# EAGLE schematic P1001-001-011-320 - RAM (EAGLE 9.4.2)

## Sheet 1 of 4
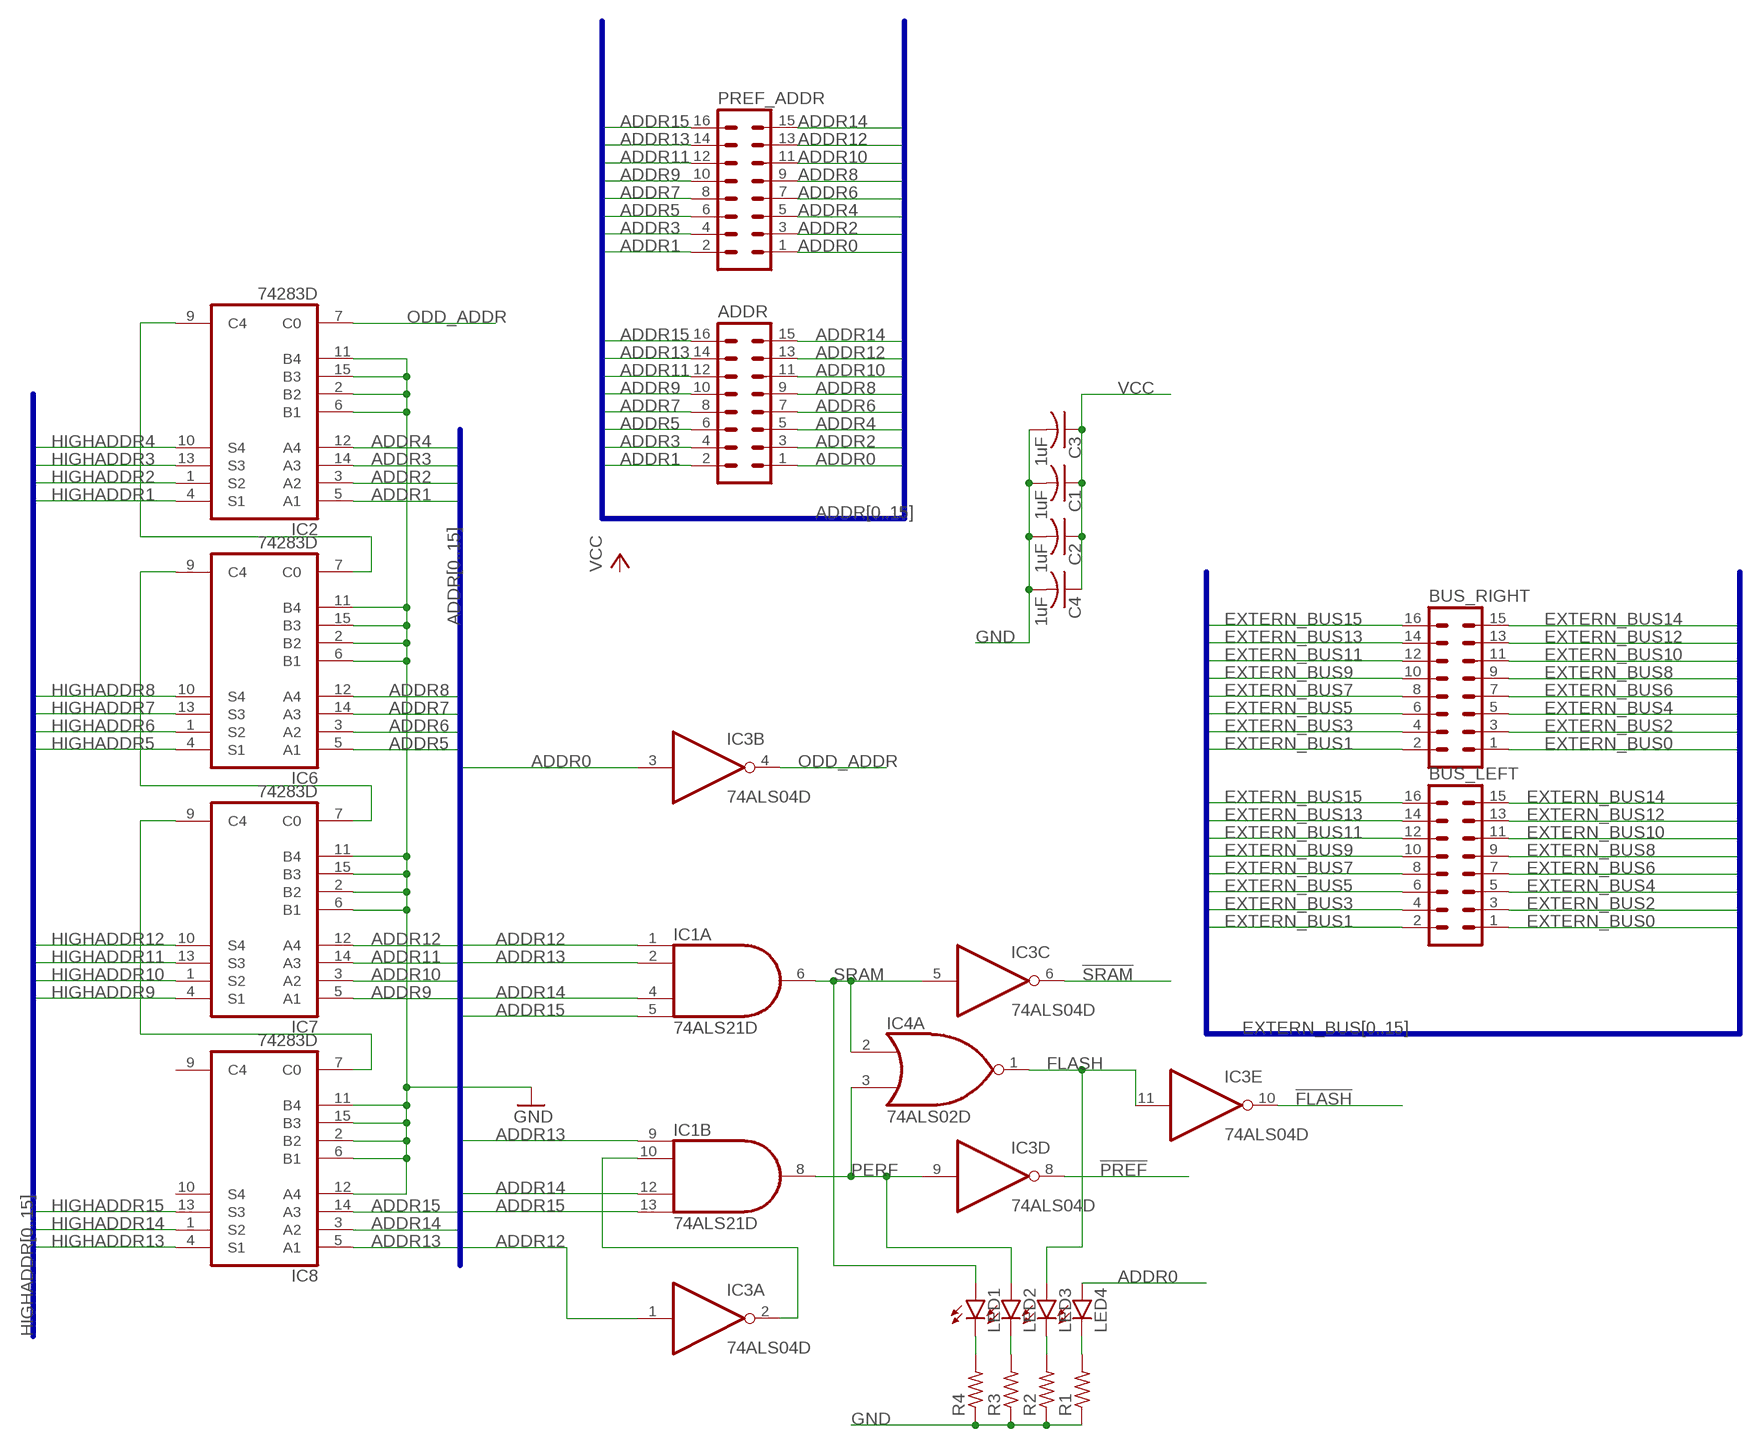
[diagram p0: schematic, sheet 1]

### Parts
ADDR  ML16  [ML16]
BUS_LEFT  ML16  [ML16]
BUS_RIGHT  ML16  [ML16]
C1  1uF  C-USC1206  [C1206]
C2  1uF  C-USC1206  [C1206]
C3  1uF  C-USC1206  [C1206]
C4  1uF  C-USC1206  [C1206]
IC1  74ALS21D  [SO14]
IC2  74283D  [SO16]
IC3  74ALS04D  [SO14]
IC4  74ALS02D  [SO14]
IC6  74283D  [SO16]
IC7  74283D  [SO16]
IC8  74283D  [SO16]
LED1  LED5MM  [LED5MM]
LED2  LED5MM  [LED5MM]
LED3  LED5MM  [LED5MM]
LED4  LED5MM  [LED5MM]
PREF_ADDR  ML16  [ML16]
R1  R-US_M1206  [M1206]
R2  R-US_M1206  [M1206]
R3  R-US_M1206  [M1206]
R4  R-US_M1206  [M1206]

### Nets
!FLASH: IC3.10(E:O) ; also sheet 3
!PREF: IC3.8(D:O) ; also sheet 4
!SRAM: IC3.6(C:O) ; also sheet 4
ADDR0: ADDR.1 IC3.3(B:I) LED4.A PREF_ADDR.1 ; also sheet 4
ADDR1: ADDR.2 IC2.5(A1) PREF_ADDR.2 ; also sheet 3,4
ADDR2: ADDR.3 IC2.3(A2) PREF_ADDR.3 ; also sheet 3,4
ADDR3: ADDR.4 IC2.14(A3) PREF_ADDR.4 ; also sheet 3,4
ADDR4: ADDR.5 IC2.12(A4) PREF_ADDR.5 ; also sheet 3,4
ADDR5: ADDR.6 IC6.5(A1) PREF_ADDR.6 ; also sheet 3,4
ADDR6: ADDR.7 IC6.3(A2) PREF_ADDR.7 ; also sheet 3,4
ADDR7: ADDR.8 IC6.14(A3) PREF_ADDR.8 ; also sheet 3,4
ADDR8: ADDR.9 IC6.12(A4) PREF_ADDR.9 ; also sheet 3,4
ADDR9: ADDR.10 IC7.5(A1) PREF_ADDR.10 ; also sheet 3,4
ADDR10: ADDR.11 IC7.3(A2) PREF_ADDR.11 ; also sheet 3,4
ADDR11: ADDR.12 IC7.14(A3) PREF_ADDR.12 ; also sheet 3,4
ADDR12: ADDR.13 IC1.1(A:I0) IC3.1(A:I) IC7.12(A4) PREF_ADDR.13 ; also sheet 3,4
ADDR13: ADDR.14 IC1.2(A:I1) IC1.9(B:I0) IC8.5(A1) PREF_ADDR.14 ; also sheet 3,4
ADDR14: ADDR.15 IC1.4(A:I2) IC1.12(B:I2) IC8.3(A2) PREF_ADDR.15 ; also sheet 3,4
ADDR15: ADDR.16 IC1.5(A:I3) IC1.13(B:I3) IC8.14(A3) PREF_ADDR.16 ; also sheet 3,4
EXTERN_BUS0: BUS_LEFT.1 BUS_RIGHT.1 ; also sheet 4
EXTERN_BUS1: BUS_LEFT.2 BUS_RIGHT.2 ; also sheet 4
EXTERN_BUS2: BUS_LEFT.3 BUS_RIGHT.3 ; also sheet 4
EXTERN_BUS3: BUS_LEFT.4 BUS_RIGHT.4 ; also sheet 4
EXTERN_BUS4: BUS_LEFT.5 BUS_RIGHT.5 ; also sheet 4
EXTERN_BUS5: BUS_LEFT.6 BUS_RIGHT.6 ; also sheet 4
EXTERN_BUS6: BUS_LEFT.7 BUS_RIGHT.7 ; also sheet 4
EXTERN_BUS7: BUS_LEFT.8 BUS_RIGHT.8 ; also sheet 4
EXTERN_BUS8: BUS_LEFT.9 BUS_RIGHT.9 ; also sheet 4
EXTERN_BUS9: BUS_LEFT.10 BUS_RIGHT.10 ; also sheet 4
EXTERN_BUS10: BUS_LEFT.11 BUS_RIGHT.11 ; also sheet 4
EXTERN_BUS11: BUS_LEFT.12 BUS_RIGHT.12 ; also sheet 4
EXTERN_BUS12: BUS_LEFT.13 BUS_RIGHT.13 ; also sheet 4
EXTERN_BUS13: BUS_LEFT.14 BUS_RIGHT.14 ; also sheet 4
EXTERN_BUS14: BUS_LEFT.15 BUS_RIGHT.15 ; also sheet 4
EXTERN_BUS15: BUS_LEFT.16 BUS_RIGHT.16 ; also sheet 4
FLASH: IC3.11(E:I) IC4.1(A:O) LED3.A
GND [power]: C1.2 C2.2 C3.2 C4.2 IC2.2(B2) IC2.6(B1) IC2.11(B4) IC2.15(B3) IC6.2(B2) IC6.6(B1) IC6.11(B4) IC6.15(B3) IC7.2(B2) IC7.6(B1) IC7.11(B4) IC7.15(B3) IC8.2(B2) IC8.6(B1) IC8.11(B4) IC8.12(A4) IC8.15(B3) R1.1 R2.1 R3.1 R4.1 ; also sheet 2,3,4
HIGHADDR1: IC2.4(S1) ; also sheet 3,4
HIGHADDR2: IC2.1(S2) ; also sheet 3,4
HIGHADDR3: IC2.13(S3) ; also sheet 3,4
HIGHADDR4: IC2.10(S4) ; also sheet 3,4
HIGHADDR5: IC6.4(S1) ; also sheet 3,4
HIGHADDR6: IC6.1(S2) ; also sheet 3,4
HIGHADDR7: IC6.13(S3) ; also sheet 3,4
HIGHADDR8: IC6.10(S4) ; also sheet 3,4
HIGHADDR9: IC7.4(S1) ; also sheet 3,4
HIGHADDR10: IC7.1(S2) ; also sheet 3,4
HIGHADDR11: IC7.13(S3) ; also sheet 3,4
HIGHADDR12: IC7.10(S4) ; also sheet 3,4
HIGHADDR13: IC8.4(S1) ; also sheet 3,4
HIGHADDR14: IC8.1(S2) ; also sheet 3,4
HIGHADDR15: IC8.13(S3) ; also sheet 3,4
N$1: IC1.10(B:I1) IC3.2(A:O)
N$3: LED1.K(C) R4.2
N$4: LED2.K(C) R3.2
N$5: LED3.K(C) R2.2
N$6: LED4.K(C) R1.2
N$37: IC2.9(C4) IC6.7(C0)
N$42: IC6.9(C4) IC7.7(C0)
N$50: IC7.9(C4) IC8.7(C0)
ODD_ADDR: IC2.7(C0) IC3.4(B:O) ; also sheet 2,3,4
PERF: IC1.8(B:O) IC3.9(D:I) IC4.3(A:I1) LED2.A
SRAM: IC1.6(A:O) IC3.5(C:I) IC4.2(A:I0) LED1.A
VCC [power]: C1.1 C2.1 C3.1 C4.1 ; also sheet 2,3,4
Unconnected: IC3.12(F:O) IC3.13(F:I) IC4.4(B:O) IC4.5(B:I0) IC4.6(B:I1) IC4.8(C:I0) IC4.9(C:I1) IC4.10(C:O) IC4.11(D:I0) IC4.12(D:I1) IC4.13(D:O) IC8.9(C4) IC8.10(S4)

### Buses
ADDR[0..15]
HIGHADDR[0..15]
EXTERN_BUS[0..15]

## Sheet 2 of 4
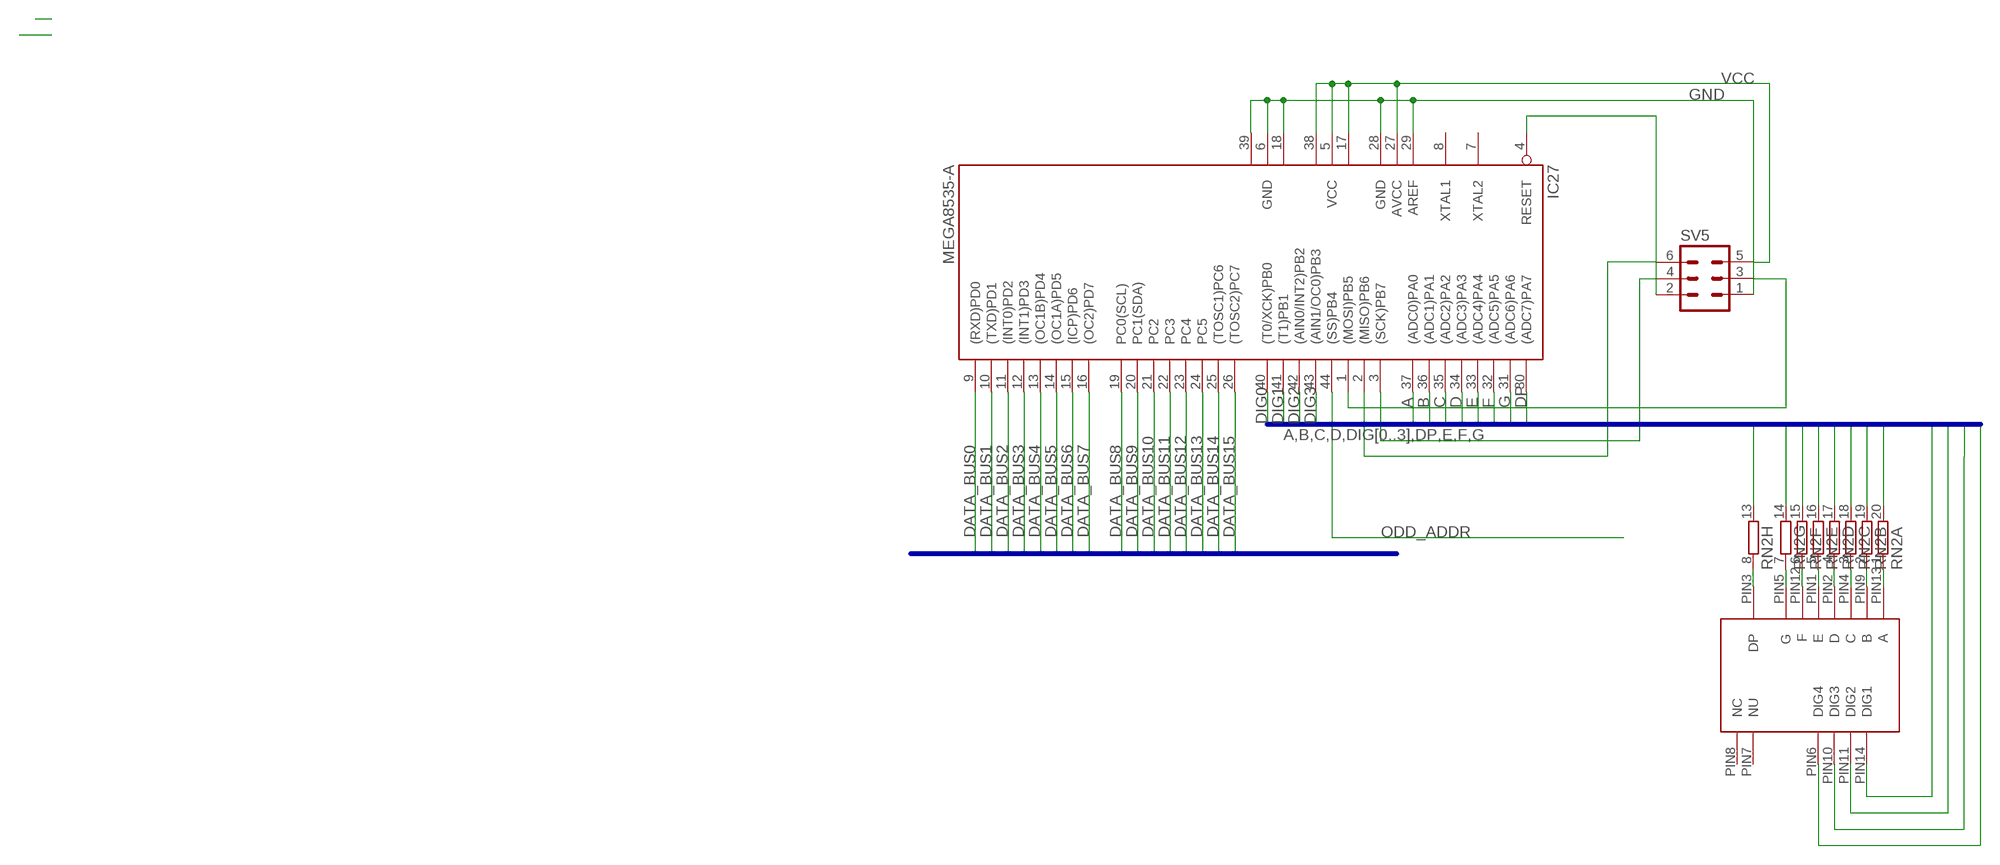
[diagram p1: schematic, sheet 2]

### Parts
IC27  MEGA8535-A  [TQFP44]
RN2  10R-NSOMC  [SOMC20]
SV5  ML6  [ML6]
U$1  4-DIGIT-7-SEGMENT  [4-DIGIT-7-SEGMENT]

### Nets
A: IC27.37((ADC0)PA0) RN2.20
B: IC27.36((ADC1)PA1) RN2.19
C: IC27.35((ADC2)PA2) RN2.18
D: IC27.34((ADC3)PA3) RN2.17
DATA_BUS0: IC27.9((RXD)PD0) ; also sheet 3,4
DATA_BUS1: IC27.10((TXD)PD1) ; also sheet 3,4
DATA_BUS2: IC27.11((INT0)PD2) ; also sheet 3,4
DATA_BUS3: IC27.12((INT1)PD3) ; also sheet 3,4
DATA_BUS4: IC27.13((OC1B)PD4) ; also sheet 3,4
DATA_BUS5: IC27.14((OC1A)PD5) ; also sheet 3,4
DATA_BUS6: IC27.15((ICP)PD6) ; also sheet 3,4
DATA_BUS7: IC27.16((OC2)PD7) ; also sheet 3,4
DATA_BUS8: IC27.19(PC0(SCL)) ; also sheet 3,4
DATA_BUS9: IC27.20(PC1(SDA)) ; also sheet 3,4
DATA_BUS10: IC27.21(PC2) ; also sheet 3,4
DATA_BUS11: IC27.22(PC3) ; also sheet 3,4
DATA_BUS12: IC27.23(PC4) ; also sheet 3,4
DATA_BUS13: IC27.24(PC5) ; also sheet 3,4
DATA_BUS14: IC27.25((TOSC1)PC6) ; also sheet 3,4
DATA_BUS15: IC27.26((TOSC2)PC7) ; also sheet 3,4
DIG0: IC27.40((T0/XCK)PB0) U$1.PIN14(DIG1)
DIG1: IC27.41((T1)PB1) U$1.PIN11(DIG2)
DIG2: IC27.42((AIN0/INT2)PB2) U$1.PIN10(DIG3)
DIG3: IC27.43((AIN1/OC0)PB3) U$1.PIN6(DIG4)
DP: IC27.30((ADC7)PA7) RN2.13
E: IC27.33((ADC4)PA4) RN2.16
F: IC27.32((ADC5)PA5) RN2.15
G: IC27.31((ADC6)PA6) RN2.14
GND [power]: IC27.6(GND) IC27.18(GND1) IC27.28(GND) IC27.29(AREF) IC27.39(GND2) SV5.1 ; also sheet 1,3,4
N$119: IC27.1((MOSI)PB5) SV5.3
N$120: IC27.3((SCK)PB7) SV5.4
N$121: IC27.2((MISO)PB6) SV5.6
N$122: IC27.4(RESET) SV5.2
N$123: RN2.1 U$1.PIN13(A)
N$124: RN2.2 U$1.PIN9(B)
N$125: RN2.3 U$1.PIN4(C)
N$126: RN2.4 U$1.PIN2(D)
N$127: RN2.5 U$1.PIN1(E)
N$128: RN2.6 U$1.PIN12(F)
N$129: RN2.7 U$1.PIN5(G)
N$130: RN2.8 U$1.PIN3(DP)
ODD_ADDR: IC27.44((SS)PB4) ; also sheet 1,3,4
VCC [power]: IC27.5(VCC) IC27.17(VCC1) IC27.27(AVCC) IC27.38(VCC2) SV5.5 ; also sheet 1,3,4
Unconnected: IC27.7(XTAL2) IC27.8(XTAL1) RN2.9 RN2.10 RN2.11 RN2.12 U$1.PIN7(NU) U$1.PIN8(NC)

### Buses
A,B,C,D,DIG[0..3],DP,E,F,G
DATA_BUS[0..15]

## Sheet 3 of 4
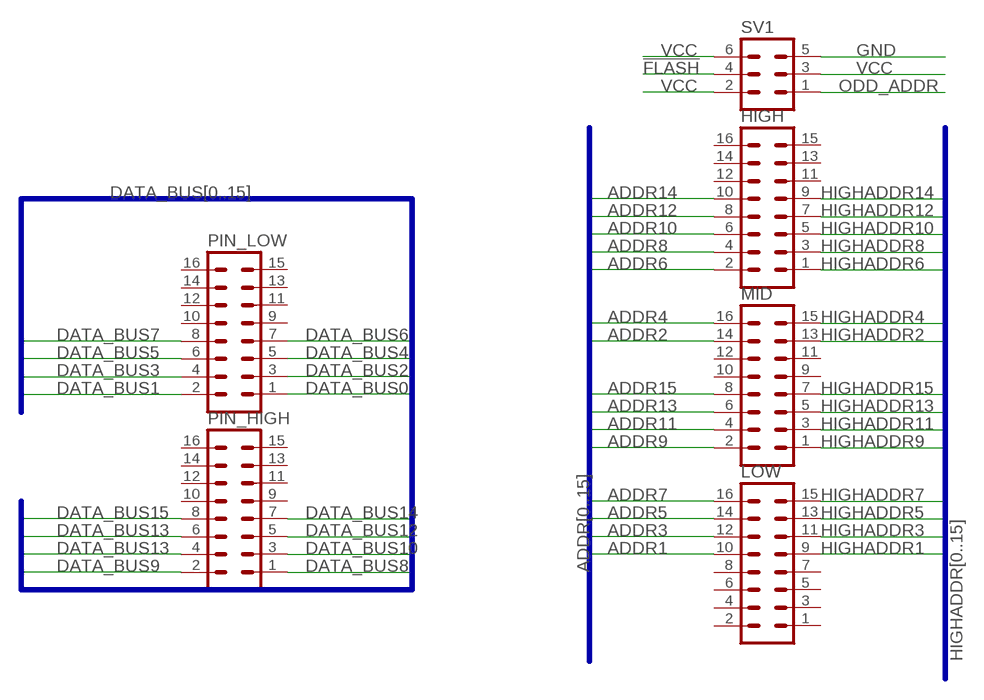
[diagram p2: schematic, sheet 3]

### Parts
HIGH  ML16  [ML16]
LOW  ML16  [ML16]
MID  ML16  [ML16]
PIN_HIGH  ML16  [ML16]
PIN_LOW  ML16  [ML16]
SV1  ML6  [ML6]

### Nets
!FLASH: SV1.4 ; also sheet 1
ADDR1: LOW.10 ; also sheet 1,4
ADDR2: MID.14 ; also sheet 1,4
ADDR3: LOW.12 ; also sheet 1,4
ADDR4: MID.16 ; also sheet 1,4
ADDR5: LOW.14 ; also sheet 1,4
ADDR6: HIGH.2 ; also sheet 1,4
ADDR7: LOW.16 ; also sheet 1,4
ADDR8: HIGH.4 ; also sheet 1,4
ADDR9: MID.2 ; also sheet 1,4
ADDR10: HIGH.6 ; also sheet 1,4
ADDR11: MID.4 ; also sheet 1,4
ADDR12: HIGH.8 ; also sheet 1,4
ADDR13: MID.6 ; also sheet 1,4
ADDR14: HIGH.10 ; also sheet 1,4
ADDR15: MID.8 ; also sheet 1,4
DATA_BUS0: PIN_LOW.1 ; also sheet 2,4
DATA_BUS1: PIN_LOW.2 ; also sheet 2,4
DATA_BUS2: PIN_LOW.3 ; also sheet 2,4
DATA_BUS3: PIN_LOW.4 ; also sheet 2,4
DATA_BUS4: PIN_LOW.5 ; also sheet 2,4
DATA_BUS5: PIN_LOW.6 ; also sheet 2,4
DATA_BUS6: PIN_LOW.7 ; also sheet 2,4
DATA_BUS7: PIN_LOW.8 ; also sheet 2,4
DATA_BUS8: PIN_HIGH.1 ; also sheet 2,4
DATA_BUS9: PIN_HIGH.2 ; also sheet 2,4
DATA_BUS10: PIN_HIGH.3 ; also sheet 2,4
DATA_BUS11: PIN_HIGH.4 ; also sheet 2,4
DATA_BUS12: PIN_HIGH.5 ; also sheet 2,4
DATA_BUS13: PIN_HIGH.6 ; also sheet 2,4
DATA_BUS14: PIN_HIGH.7 ; also sheet 2,4
DATA_BUS15: PIN_HIGH.8 ; also sheet 2,4
GND [power]: SV1.5 ; also sheet 1,2,4
HIGHADDR1: LOW.9 ; also sheet 1,4
HIGHADDR2: MID.13 ; also sheet 1,4
HIGHADDR3: LOW.11 ; also sheet 1,4
HIGHADDR4: MID.15 ; also sheet 1,4
HIGHADDR5: LOW.13 ; also sheet 1,4
HIGHADDR6: HIGH.1 ; also sheet 1,4
HIGHADDR7: LOW.15 ; also sheet 1,4
HIGHADDR8: HIGH.3 ; also sheet 1,4
HIGHADDR9: MID.1 ; also sheet 1,4
HIGHADDR10: HIGH.5 ; also sheet 1,4
HIGHADDR11: MID.3 ; also sheet 1,4
HIGHADDR12: HIGH.7 ; also sheet 1,4
HIGHADDR13: MID.5 ; also sheet 1,4
HIGHADDR14: HIGH.9 ; also sheet 1,4
HIGHADDR15: MID.7 ; also sheet 1,4
ODD_ADDR: SV1.1 ; also sheet 1,2,4
VCC [power]: SV1.2 SV1.3 SV1.6 ; also sheet 1,2,4
Unconnected: HIGH.11 HIGH.12 HIGH.13 HIGH.14 HIGH.15 HIGH.16 LOW.1 LOW.2 LOW.3 LOW.4 LOW.5 LOW.6 LOW.7 LOW.8 MID.9 MID.10 MID.11 MID.12 PIN_HIGH.9 PIN_HIGH.10 PIN_HIGH.11 PIN_HIGH.12 PIN_HIGH.13 PIN_HIGH.14 PIN_HIGH.15 PIN_HIGH.16 PIN_LOW.9 PIN_LOW.10 PIN_LOW.11 PIN_LOW.12 PIN_LOW.13 PIN_LOW.14 PIN_LOW.15 PIN_LOW.16

### Buses
DATA_BUS[0..15]
ADDR[0..15]
HIGHADDR[0..15]

## Sheet 4 of 4
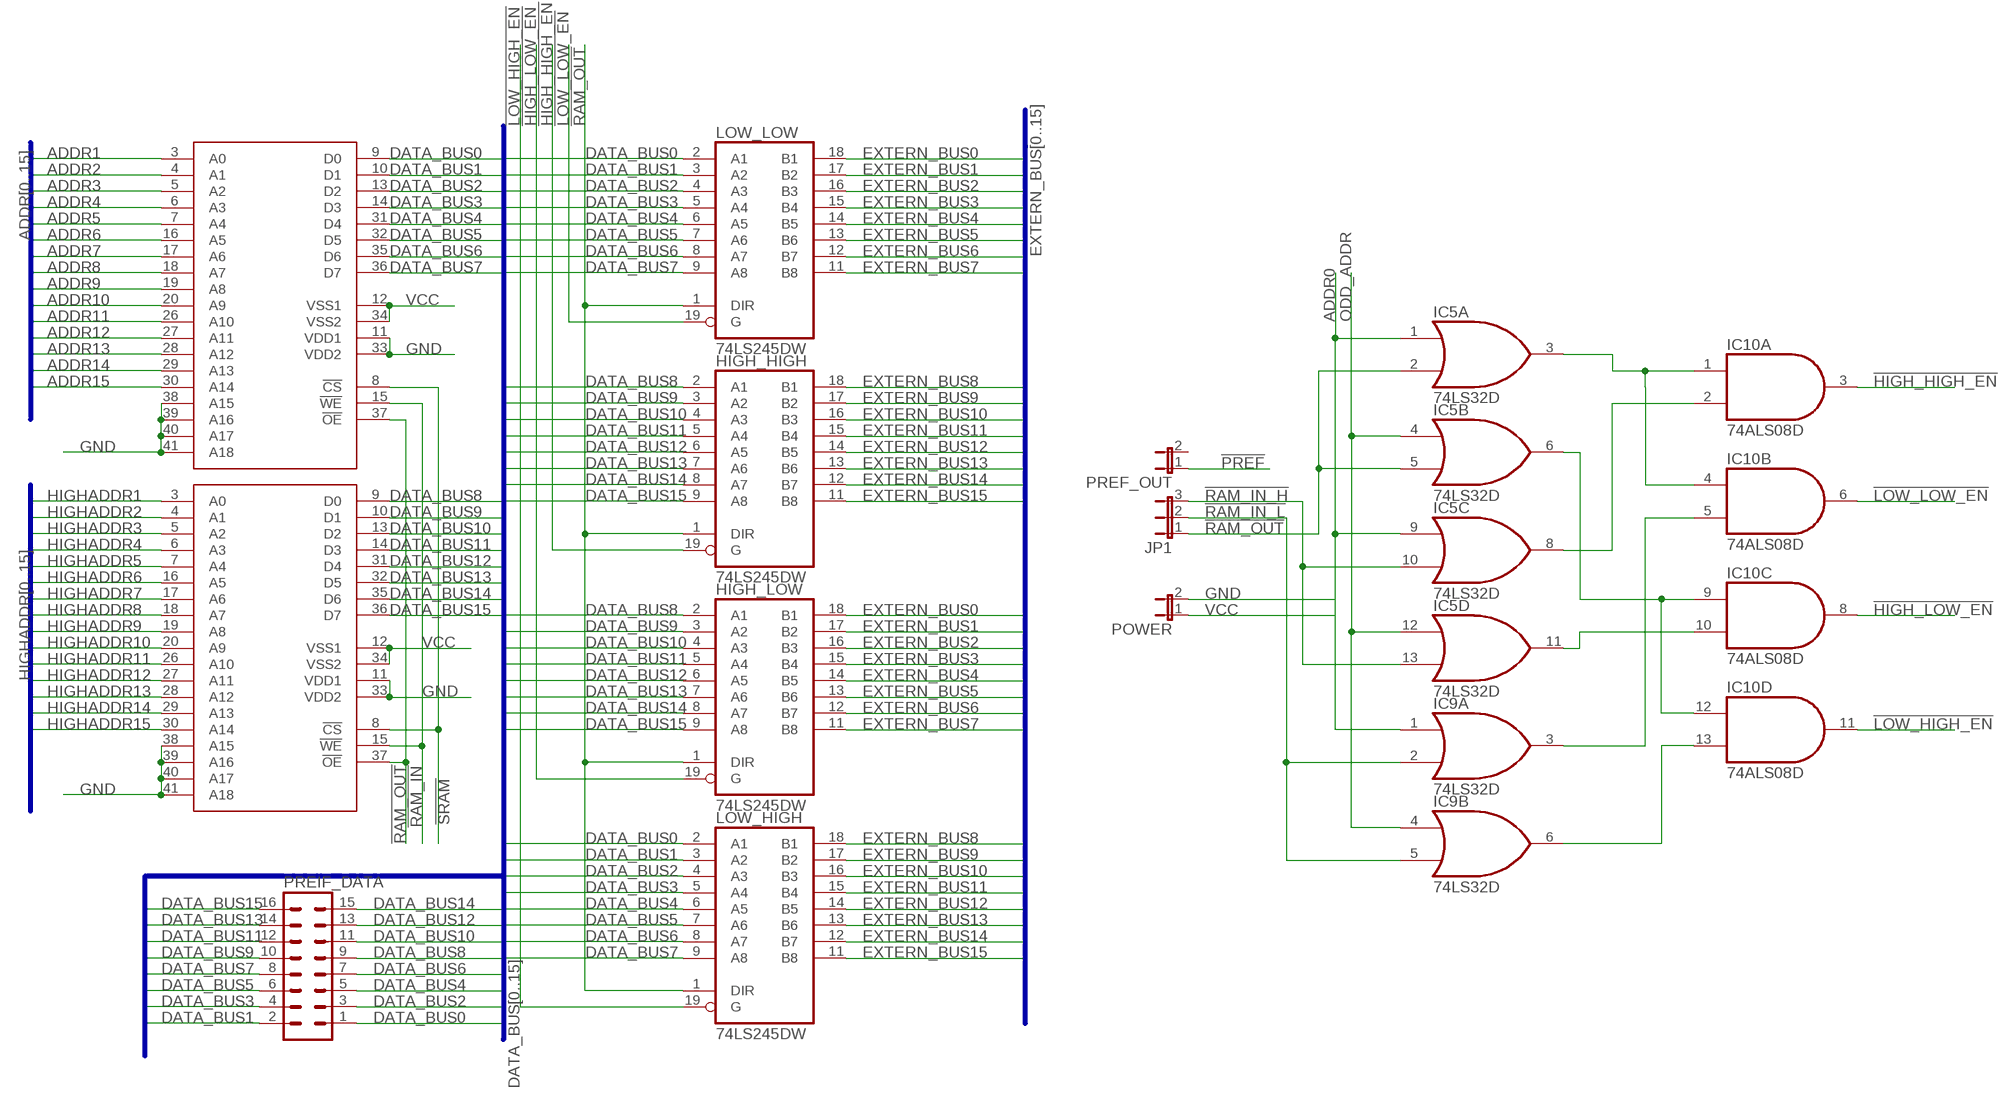
[diagram p3: schematic, sheet 4]

### Parts
HIGH_HIGH  74LS245DW  [SO20W]
HIGH_LOW  74LS245DW  [SO20W]
IC5  74LS32D  [SO14]
IC9  74LS32D  [SO14]
IC10  74ALS08D  [SO14]
JP1  JP2E  [JP2]
LOW_HIGH  74LS245DW  [SO20W]
LOW_LOW  74LS245DW  [SO20W]
MEM_HIGH  IDT71V424S  [TSOP44-II]
MEM_LOW  IDT71V424S  [TSOP44-II]
POWER  JP1E  [JP1]
PREF_OUT  JP1E  [JP1]
PREIF_DATA  ML16  [ML16]

### Nets
!HIGH_HIGH_EN: HIGH_HIGH.19(G) IC10.3(A:O)
!HIGH_LOW_EN: HIGH_LOW.19(G) IC10.8(C:O)
!LOW_HIGH_EN: IC10.11(D:O) LOW_HIGH.19(G)
!LOW_LOW_EN: IC10.6(B:O) LOW_LOW.19(G)
!PREF: PREF_OUT.1 ; also sheet 1
!RAM_IN: MEM_HIGH.15(!WE) MEM_LOW.15(!WE)
!RAM_IN_H: IC5.10(C:I1) IC5.13(D:I1) JP1.3
!RAM_IN_L: IC9.2(A:I1) IC9.5(B:I1) JP1.2
!RAM_OUT: HIGH_HIGH.1(DIR) HIGH_LOW.1(DIR) IC5.2(A:I1) IC5.5(B:I1) JP1.1 LOW_HIGH.1(DIR) LOW_LOW.1(DIR) MEM_HIGH.37(!OE) MEM_LOW.37(!OE)
!SRAM: MEM_HIGH.8(!CS) MEM_LOW.8(!CS) ; also sheet 1
ADDR0: IC5.1(A:I0) IC5.9(C:I0) IC9.1(A:I0) ; also sheet 1
ADDR1: MEM_LOW.3(A0) ; also sheet 1,3
ADDR2: MEM_LOW.4(A1) ; also sheet 1,3
ADDR3: MEM_LOW.5(A2) ; also sheet 1,3
ADDR4: MEM_LOW.6(A3) ; also sheet 1,3
ADDR5: MEM_LOW.7(A4) ; also sheet 1,3
ADDR6: MEM_LOW.16(A5) ; also sheet 1,3
ADDR7: MEM_LOW.17(A6) ; also sheet 1,3
ADDR8: MEM_LOW.18(A7) ; also sheet 1,3
ADDR9: MEM_LOW.19(A8) ; also sheet 1,3
ADDR10: MEM_LOW.20(A9) ; also sheet 1,3
ADDR11: MEM_LOW.26(A10) ; also sheet 1,3
ADDR12: MEM_LOW.27(A11) ; also sheet 1,3
ADDR13: MEM_LOW.28(A12) ; also sheet 1,3
ADDR14: MEM_LOW.29(A13) ; also sheet 1,3
ADDR15: MEM_LOW.30(A14) ; also sheet 1,3
DATA_BUS0: LOW_HIGH.2(A1) LOW_LOW.2(A1) MEM_LOW.9(D0) PREIF_DATA.1 ; also sheet 2,3
DATA_BUS1: LOW_HIGH.3(A2) LOW_LOW.3(A2) MEM_LOW.10(D1) PREIF_DATA.2 ; also sheet 2,3
DATA_BUS2: LOW_HIGH.4(A3) LOW_LOW.4(A3) MEM_LOW.13(D2) PREIF_DATA.3 ; also sheet 2,3
DATA_BUS3: LOW_HIGH.5(A4) LOW_LOW.5(A4) MEM_LOW.14(D3) PREIF_DATA.4 ; also sheet 2,3
DATA_BUS4: LOW_HIGH.6(A5) LOW_LOW.6(A5) MEM_LOW.31(D4) PREIF_DATA.5 ; also sheet 2,3
DATA_BUS5: LOW_HIGH.7(A6) LOW_LOW.7(A6) MEM_LOW.32(D5) PREIF_DATA.6 ; also sheet 2,3
DATA_BUS6: LOW_HIGH.8(A7) LOW_LOW.8(A7) MEM_LOW.35(D6) PREIF_DATA.7 ; also sheet 2,3
DATA_BUS7: LOW_HIGH.9(A8) LOW_LOW.9(A8) MEM_LOW.36(D7) PREIF_DATA.8 ; also sheet 2,3
DATA_BUS8: HIGH_HIGH.2(A1) HIGH_LOW.2(A1) MEM_HIGH.9(D0) PREIF_DATA.9 ; also sheet 2,3
DATA_BUS9: HIGH_HIGH.3(A2) HIGH_LOW.3(A2) MEM_HIGH.10(D1) PREIF_DATA.10 ; also sheet 2,3
DATA_BUS10: HIGH_HIGH.4(A3) HIGH_LOW.4(A3) MEM_HIGH.13(D2) PREIF_DATA.11 ; also sheet 2,3
DATA_BUS11: HIGH_HIGH.5(A4) HIGH_LOW.5(A4) MEM_HIGH.14(D3) PREIF_DATA.12 ; also sheet 2,3
DATA_BUS12: HIGH_HIGH.6(A5) HIGH_LOW.6(A5) MEM_HIGH.31(D4) PREIF_DATA.13 ; also sheet 2,3
DATA_BUS13: HIGH_HIGH.7(A6) HIGH_LOW.7(A6) MEM_HIGH.32(D5) PREIF_DATA.14 ; also sheet 2,3
DATA_BUS14: HIGH_HIGH.8(A7) HIGH_LOW.8(A7) MEM_HIGH.35(D6) PREIF_DATA.15 ; also sheet 2,3
DATA_BUS15: HIGH_HIGH.9(A8) HIGH_LOW.9(A8) MEM_HIGH.36(D7) PREIF_DATA.16 ; also sheet 2,3
EXTERN_BUS0: HIGH_LOW.18(B1) LOW_LOW.18(B1) ; also sheet 1
EXTERN_BUS1: HIGH_LOW.17(B2) LOW_LOW.17(B2) ; also sheet 1
EXTERN_BUS2: HIGH_LOW.16(B3) LOW_LOW.16(B3) ; also sheet 1
EXTERN_BUS3: HIGH_LOW.15(B4) LOW_LOW.15(B4) ; also sheet 1
EXTERN_BUS4: HIGH_LOW.14(B5) LOW_LOW.14(B5) ; also sheet 1
EXTERN_BUS5: HIGH_LOW.13(B6) LOW_LOW.13(B6) ; also sheet 1
EXTERN_BUS6: HIGH_LOW.12(B7) LOW_LOW.12(B7) ; also sheet 1
EXTERN_BUS7: HIGH_LOW.11(B8) LOW_LOW.11(B8) ; also sheet 1
EXTERN_BUS8: HIGH_HIGH.18(B1) LOW_HIGH.18(B1) ; also sheet 1
EXTERN_BUS9: HIGH_HIGH.17(B2) LOW_HIGH.17(B2) ; also sheet 1
EXTERN_BUS10: HIGH_HIGH.16(B3) LOW_HIGH.16(B3) ; also sheet 1
EXTERN_BUS11: HIGH_HIGH.15(B4) LOW_HIGH.15(B4) ; also sheet 1
EXTERN_BUS12: HIGH_HIGH.14(B5) LOW_HIGH.14(B5) ; also sheet 1
EXTERN_BUS13: HIGH_HIGH.13(B6) LOW_HIGH.13(B6) ; also sheet 1
EXTERN_BUS14: HIGH_HIGH.12(B7) LOW_HIGH.12(B7) ; also sheet 1
EXTERN_BUS15: HIGH_HIGH.11(B8) LOW_HIGH.11(B8) ; also sheet 1
GND [power]: MEM_HIGH.11(VDD1) MEM_HIGH.33(VDD2) MEM_HIGH.38(A15) MEM_HIGH.39(A16) MEM_HIGH.40(A17) MEM_HIGH.41(A18) MEM_LOW.11(VDD1) MEM_LOW.33(VDD2) MEM_LOW.38(A15) MEM_LOW.39(A16) MEM_LOW.40(A17) MEM_LOW.41(A18) POWER.2 ; also sheet 1,2,3
HIGHADDR1: MEM_HIGH.3(A0) ; also sheet 1,3
HIGHADDR2: MEM_HIGH.4(A1) ; also sheet 1,3
HIGHADDR3: MEM_HIGH.5(A2) ; also sheet 1,3
HIGHADDR4: MEM_HIGH.6(A3) ; also sheet 1,3
HIGHADDR5: MEM_HIGH.7(A4) ; also sheet 1,3
HIGHADDR6: MEM_HIGH.16(A5) ; also sheet 1,3
HIGHADDR7: MEM_HIGH.17(A6) ; also sheet 1,3
HIGHADDR8: MEM_HIGH.18(A7) ; also sheet 1,3
HIGHADDR9: MEM_HIGH.19(A8) ; also sheet 1,3
HIGHADDR10: MEM_HIGH.20(A9) ; also sheet 1,3
HIGHADDR11: MEM_HIGH.26(A10) ; also sheet 1,3
HIGHADDR12: MEM_HIGH.27(A11) ; also sheet 1,3
HIGHADDR13: MEM_HIGH.28(A12) ; also sheet 1,3
HIGHADDR14: MEM_HIGH.29(A13) ; also sheet 1,3
HIGHADDR15: MEM_HIGH.30(A14) ; also sheet 1,3
N$2: IC5.3(A:O) IC10.1(A:I0) IC10.4(B:I0)
N$7: IC5.8(C:O) IC10.2(A:I1)
N$8: IC9.3(A:O) IC10.5(B:I1)
N$9: IC5.6(B:O) IC10.9(C:I0) IC10.12(D:I0)
N$10: IC5.11(D:O) IC10.10(C:I1)
N$11: IC9.6(B:O) IC10.13(D:I1)
ODD_ADDR: IC5.4(B:I0) IC5.12(D:I0) IC9.4(B:I0) ; also sheet 1,2,3
VCC [power]: MEM_HIGH.12(VSS1) MEM_HIGH.34(VSS2) MEM_LOW.12(VSS1) MEM_LOW.34(VSS2) POWER.1 ; also sheet 1,2,3
Unconnected: IC9.8(C:O) IC9.9(C:I0) IC9.10(C:I1) IC9.11(D:O) IC9.12(D:I0) IC9.13(D:I1) PREF_OUT.2

### Buses
EXTERN_BUS[0..15]
DATA_BUS[0..15]
ADDR[0..15]
HIGHADDR[0..15]

## Power pins joined to a net without a drawn wire
GND: HIGH_HIGH.10(GND) HIGH_LOW.10(GND) IC1.7(P:GND) IC2.8(GND) IC3.7(P:GND) IC4.7(P:GND) IC5.7(P:GND) IC6.8(GND) IC7.8(GND) IC8.8(GND) IC9.7(P:GND) IC10.7(P:GND) LOW_HIGH.10(GND) LOW_LOW.10(GND)
VCC: HIGH_HIGH.20(VCC) HIGH_LOW.20(VCC) IC1.14(P:VCC) IC2.16(VCC) IC3.14(P:VCC) IC4.14(P:VCC) IC5.14(P:VCC) IC6.16(VCC) IC7.16(VCC) IC8.16(VCC) IC9.14(P:VCC) IC10.14(P:VCC) LOW_HIGH.20(VCC) LOW_LOW.20(VCC)

## Library data of the parts
ADDR BUS_LEFT BUS_RIGHT HIGH LOW MID PIN_HIGH PIN_LOW PREF_ADDR PREIF_DATA = con-harting-ml:ML16: HARTING; OC_FARNELL: unknown; OC_NEWARK: unknown
C1-C4 = rcl:C-US: CAPACITOR, American symbol; SPICEPREFIX: C
HIGH_HIGH HIGH_LOW LOW_HIGH LOW_LOW = 74xx-us:74*245: Octal BUS TRANSCEIVER, 3-state
IC1 = 74xx-us:74*21: Dual 4-input AND gate
IC2 IC6-IC8 = 74xx-us:74*283: 4-bit binary FULL ADDER, fast carry
IC3 = 74xx-us:74*04: Hex INVERTER
IC4 = 74xx-us:74*02: Quad 2-input NOR gate
IC5 IC9 = 74xx-us:74*32: Quad 2-input OR gate
IC10 = 74xx-us:74*08: Quad 2-input AND gate
IC27 = atmel:MEGA8535: MICROCONTROLLER 8 Kbytes FLASH 512 bytes SRAM 512 bytes EEPROM USART 8-channel 10 bit ADC Source: avr.lbr; MPN: ATMEGA8535-16AU; OC_FARNELL: 1528437; OC_NEWARK: 01M6908
JP1 = jumper:JP2E: JUMPER
LED1-LED4 = led:LED: LED OSRAM: - CHIPLED LG R971, LG N971, LY N971, LG Q971, LY Q971, LO R971, LY R971 LH N974, LH R974 LS Q976, LO Q976, LY Q976 LO Q996 - Hyper CHIPLED LW Q18S LB Q993, LB Q99A, LB R99A - SideLED LS A670, LO A670, LY A670, LG A670, LP A670 LB A673, LV A673, LT A673, LW A673 LH A674 LY A675 LS A676, LA A676, LO A676, LY A676, LW A676 LS A679, LY A679, LG A679 - Hyper Micro SIDELED® LS Y876, LA Y876, LO Y876, LY Y876 LT Y87S - SmartLED LW L88C, LW L88S LB L89C, LB L89S, LG L890 LS L89K, LO L89K, LY L89K LS L896, LA L896, LO L896, LY L896 - TOPLED LS T670, LO T670, LY T670, LG T670, LP T670 LSG T670, LSP T670, LSY T670, LOP T670, LYG T670 LG T671, LOG T671, LSG T671 LB T673, LV T673, LT T673, LW T673 LH T674 LS T676, LA T676, LO T676, LY T676, LB T676, LH T676, LSB T676, LW T676 LB T67C, LV T67C, LT T67C, LS T67K, LO T67K, LY T67K, LW E67C LS E67B, LA E67B, LO E67B, LY E67B, LB E67C, LV E67C, LT E67C LW T67C LS T679, LY T679, LG T679 LS T770, LO T770, LY T770, LG T770, LP T770 LB T773, LV T773, LT T773, LW T773 LH T774 LS E675, LA E675, LY E675, LS T675 LS T776, LA T776, LO T776, LY T776, LB T776 LHGB T686 LT T68C, LB T68C - Hyper Mini TOPLED® LB M676 - Mini TOPLED Santana® LG M470 LS M47K, LO M47K, LY M47K Source: http://www.osram.convergy.de LUXEON: - LUMILED® LXK2-PW12-R00, LXK2-PW12-S00, LXK2-PW14-U00, LXK2-PW14-V00 LXK2-PM12-R00, LXK2-PM12-S00, LXK2-PM14-U00 LXK2-PE12-Q00, LXK2-PE12-R00, LXK2-PE12-S00, LXK2-PE14-T00, LXK2-PE14-U00 LXK2-PB12-K00, LXK2-PB12-L00, LXK2-PB12-M00, LXK2-PB14-N00, LXK2-PB14-P00, LXK2-PB14-Q00 LXK2-PR12-L00, LXK2-PR12-M00, LXK2-PR14-Q00, LXK2-PR14-R00 LXK2-PD12-Q00, LXK2-PD12-R00, LXK2-PD12-S00 LXK2-PH12-R00, LXK2-PH12-S00 LXK2-PL12-P00, LXK2-PL12-Q00, LXK2-PL12-R00 Source: www.luxeon.com KINGBRIGHT: KA-3528ASYC Source: www.kingbright.com
MEM_HIGH MEM_LOW = 16bit:IDT71V424S
POWER PREF_OUT = jumper:JP1E: JUMPER
R1-R4 = rcl:R-US_: RESISTOR, American symbol; SPICEPREFIX: R
RN2 = resistor-dil:10R-N: DIL RESISTOR; OC_FARNELL: unknown; OC_NEWARK: unknown
SV1 SV5 = con-harting-ml:ML6: HARTING; OC_FARNELL: unknown; OC_NEWARK: unknown
U$1 = ADAFRUIT:4-DIGIT-7-SEGMENT

## Net classes
1 power: width 0.457 mm